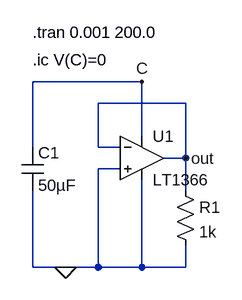
[diagram p0: schematic opamp_RC_bypass_LT1366.asc]
opamp_RC_bypass_LT1366.asc, the LTspice schematic file:
Version 4
SHEET 1 880 680
WIRE 80 144 -80 144
WIRE 144 176 16 176
WIRE 80 224 80 144
WIRE -80 240 -80 144
WIRE 16 240 16 176
WIRE 48 240 16 240
WIRE 144 256 144 176
WIRE 144 256 112 256
WIRE 48 272 16 272
WIRE 144 304 144 256
WIRE -80 416 -80 304
WIRE -32 416 -80 416
WIRE 16 416 16 272
WIRE 16 416 -32 416
WIRE 80 416 80 288
WIRE 80 416 16 416
WIRE 144 416 144 384
WIRE 144 416 80 416
FLAG -32 416 0
FLAG 80 144 C
FLAG 144 256 out
SYMBOL cap -96 240 R0
SYMATTR InstName C1
SYMATTR Value 50µF
SYMBOL res 128 288 R0
SYMATTR InstName R1
SYMATTR Value 1k
SYMBOL Opamps/LT1366 80 192 R0
SYMATTR InstName U1
TEXT -80 112 Left 2 !.ic V(C)=0
TEXT -80 72 Left 2 !.tran 0.001 200.0

The netlist it stands for:
* opamp_RC_bypass_LT1366.asc
C1 C 0 50µF
R1 out 0 1k
XU1 0 out C 0 out LT1366  ; pins In+ In- V+ V- OUT
.ic V(C)=0
.tran 0.001 200.0
.lib LTC.lib
.backanno
.end